# Altium project TIDA-010086_mod.PrjPcb (part 5 of 11)
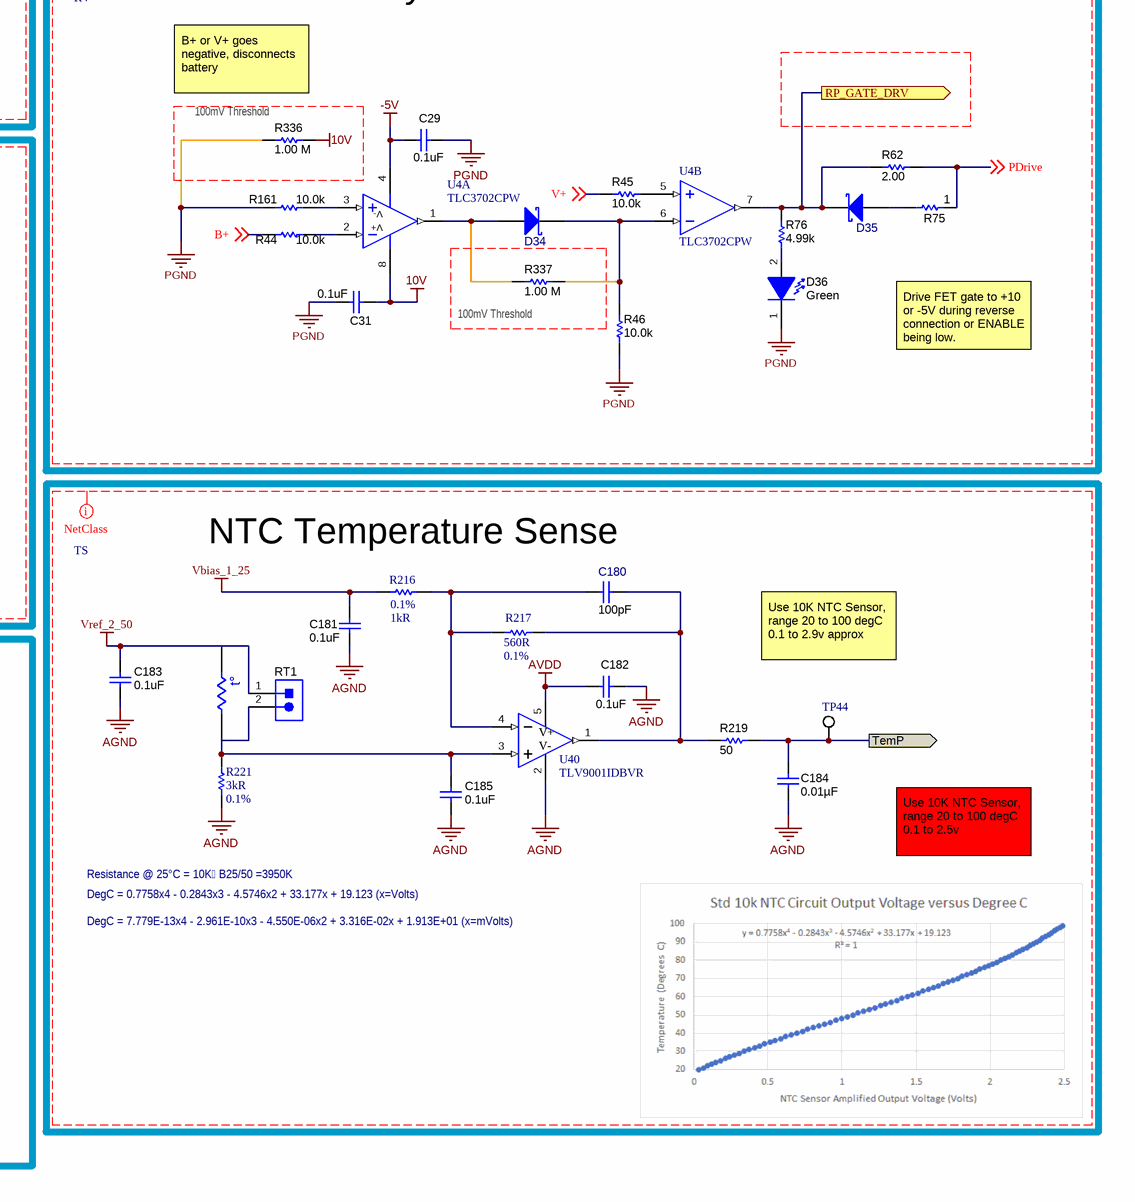
[diagram p121: XTIDA-010086_Power Stage.SchDoc, bottom right]

## Sheet XTIDA-010086_Power Stage.SchDoc: Power Stage (continued)

### Library data of the parts (continued)
U2 U5 U6 = Opamp_Dual: 36V, Low Power, RRO, General Purpose Operational Amplifier, D0008A (SOIC-8); Alternate Manufacturer: Texas Instruments; SizeAreaWB_mm2: 56.58; U/M: EA; SizeZ_mm: 1.75; SizeX_mm: 4.9; SizeY_mm: 6.2; SizeArea_mm2: 30.38; CompType: IC; ComponentLink1URL: http://www.ti.com/lit/ds/symlink/tlv2171.pdf; Publisher: Texas Instruments; PackageDescription: SOIC-8; RoHS: Y; Footprint Path 6: C:\AltiumLibraries\Footprints\TI\.PcbLib; MountType: SMT; Manufacturer: Texas Instruments; PackageReference: D0008A; LatestRevisionDate: 2017-06-09; PartNumber: TLV2171IDR; ComponentLink1Description: Datasheet Link; PartId: 1
U3 U36 = INA818ID: Noise Low-Power Precision Instrumentation Amplifier 35uV Offset 8nV/√Hz 8-Pin SOIC T/R; Manufacturer Part Number: INA818IDR; SourceLibrary: TI_2020-04-29; Built_By: EMA_Rebekah; Vendor: Texas Instruments; Copyright: Copyright (C) 2018 Accelerated Designs. All rights reserved; Manufacturer_Part_Number: INA818ID; RefDes: RefDes; Type: DEV; Supplier 1: Digi-Key; Manufacturer: Texas Instruments; RoHS: No; Category: Amplifiers - Op Amps, Buffer, Instrumentation; Stock 1: 3157; Pricing 1: 1=4.78000, 10=4.29400, 25=4.05920, 100=3.33740, 250=2.99464, 500=2.88640, 1000=2.39932 (USD); PartNumber: INA818ID
U4 = TLC3702CPW: Dual, Micropower, Push-Pull Outputs, LinCMOS(TM) Voltage Comparator; Manufacturer: Texas Instruments; INDUSTRY_STD_PKG_TYPE: TSSOP; PIN_COUNT: 8; PACKAGE_DESIGNATOR: PW; Datasheet_URL: http://www.ti.com/lit/gpn/TLC3702; FAMILY_NAME: COMPARATOR; GENERIC_PART_NUMBER: TLC3702; Vendor: Texas Instruments; Manufacturer_Part_Number: TLC3702CPW; Copyright: Copyright (C) 2018 Accelerated Designs. All rights reserved; RefDes: RefDes; Type: DEV; PartNumber: TLC3702CPW
U10 = OpAmp_Single_SOTSTD: 36V, Low-Power, RRO, General-Purpose Operational Amplifier, DBV0005A (SOT-23-5); Alternate PartNumber: TLV171IDBVT; Alternate Manufacturer: Texas Instruments; SizeAreaWB_mm2: 14.82; U/M: EA; SizeZ_mm: 1.45; SizeX_mm: 2.8; SizeY_mm: 2.9; SizeArea_mm2: 8.12; CompType: IC; ComponentLink1URL: http://www.ti.com/lit/ds/symlink/tlv171.pdf; Publisher: Texas Instruments; PackageDescription: SOT-23-5; RoHS: Y; Footprint Path 6: C:\AltiumLibraries\Footprints\TI\.PcbLib; MountType: SMT; Manufacturer: Texas Instruments; PackageReference: DBV0005A; LatestRevisionDate: 2017-06-09; PartNumber: TLV171IDBVR; ComponentLink1Description: Datasheet Link
U37 = TI-OPA_SM7XXXX-DBV5: Precision, 20 MHz, 0.9 pA Ib, RRIO, CMOS Operational Amplifier, 1.8 to 5.5 V, -40 to 125 degC, 5-pin SOT23 (DBV5), Green (RoHS & no Sb/Br); Manufacturer: Texas Instruments; Vio (25C)(Max)(mV): 0.15; Number of Channels: 2; Slew Rate(Typ)(V/us): 10; CMRR(Min)(dB): 100; Sub Family: High Output Current Amplifier (>=50mA), Low Input Bias Current Amp (<=10pA), Low Noise Amp (<=10nV/rtHz), Low Offset Voltage Amplifier (<=500uV), Low Supply Voltage Amplifier (<=2.7V), Precision Amplifier; Total Supply Voltage(Min)(+5V is 5, +/-5V is 10): 1.8; Iq per channel(Max)(mA): 1.75; Vn at 1kHz(Typ)(nV/rtHz): 8.5; Offset Drift(Typ)(uV/C): 1.5; IIB(Max)(pA): 0.9; Total Supply Voltage(Max)(+5V is 5, +/-5V is 10): 5.5; PackageVersion: 4073253-4/K, 03/2006; Code_JEDEC: MO-178; ComponentLink2Description: Datasheet; PackageDescription: 5-Pin Plastic Small Outline, Body 1.6 x 2.9 mm, Pitch 0.95 mm; Eco-Plan: Green (RoHS & no Sb/Br); ComponentLink1Description: Manufacturer URL; Mounting Technology: Surface Mount; ComponentLink3Description: Package Specification; ComponentLink3URL: http://www.ti.com/litv/pdf/mpds018i; PackageReference: DBV0005A; PartNumber: OPA320AIDBVR; ComponentLink2URL: http://www.ti.com/general/docs/lit/getliterature.tsp?genericPartNumber=OPA320&fileType=pdf; DatasheetVersion: SBOS513D; ComponentLink1URL: http://www.ti.com/
U40 = TLV9001IDBVR: No Description Available; Manufacturer: Texas Instruments; PartNumber: TLV9001IDBVR; RefDes: RefDes; Type: DEV; Value: Value; Copyright: Copyright (C) 2018 Accelerated Designs. All rights reserved